# EAGLE design LASERTAG (EAGLE 6.6.0)
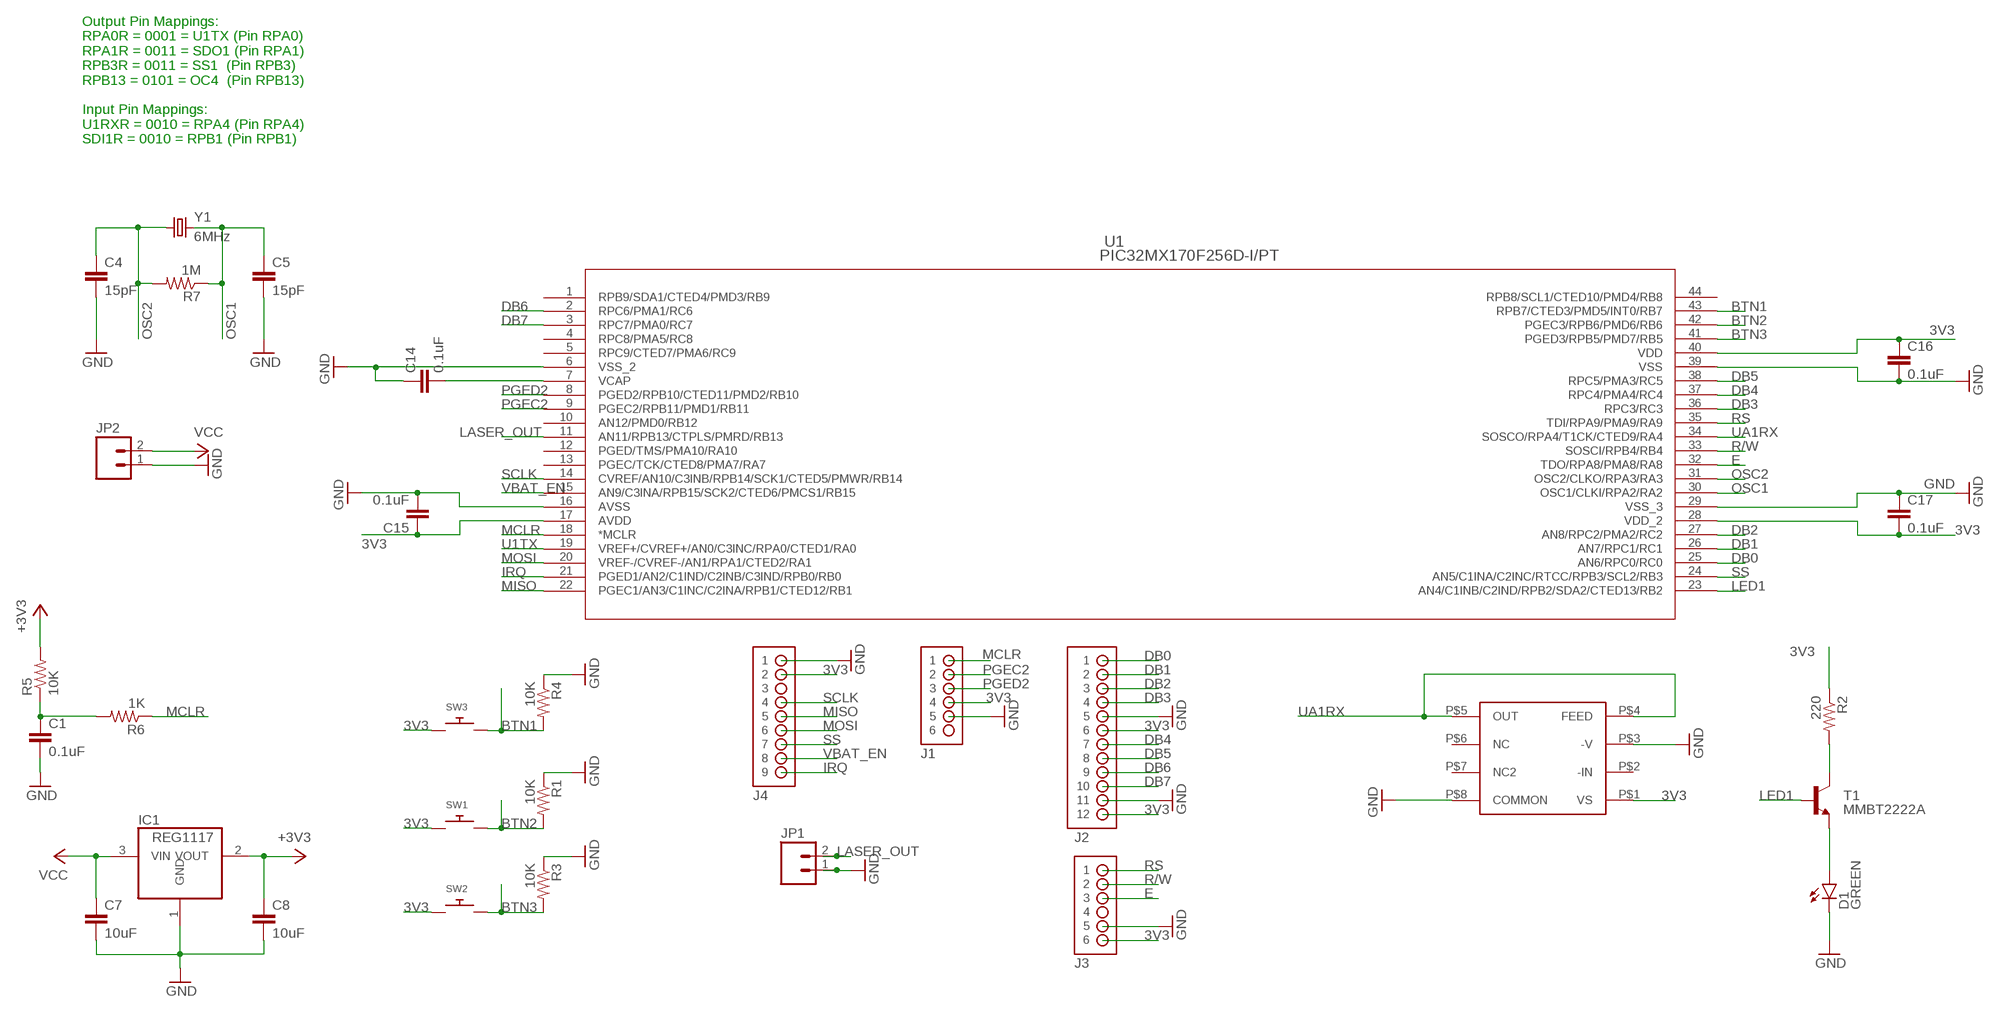
[diagram p0: schematic, sheet 1]

## Parts
C1  0.1uF  CAP0603-CAP  [0603-CAP]
C4  15pF  15PF-50V-5%(0603)  [0603-CAP]
C5  15pF  15PF-50V-5%(0603)  [0603-CAP]
C7  10uF  10UF-6.3V-20%(0603)  [0603-CAP]
C8  10uF  10UF-6.3V-20%(0603)  [0603-CAP]
C14  0.1uF  CAP0603-CAP  [0603-CAP]
C15  0.1uF  CAP0603-CAP  [0603-CAP]
C16  0.1uF  CAP0603-CAP  [0603-CAP]
C17  0.1uF  CAP0603-CAP  [0603-CAP]
D1  GREEN  LED-GREEN0603  [LED-0603]
IC1  REG1117  [SOT223]
IC3  OPT101P  [OPT101P]
J1  HDR-1X6  [HDR-1X6]
J2  PMOD-2X6-P  [PMOD-2X6-P]
J3  HDR-1X6  [HDR-1X6]
J4  HDR-1X9  [HDR-1X9]
JP1  M02JST-PTH-2  [JST-2-PTH]
JP2  M02JST-PTH-2  [JST-2-PTH]
R1  10K  RESISTOR0603-RES  [0603-RES]
R2  220  RESISTOR0603-RES  [0603-RES]
R3  10K  RESISTOR0603-RES  [0603-RES]
R4  10K  RESISTOR0603-RES  [0603-RES]
R5  10K  RESISTOR0603-RES  [0603-RES]
R6  1K  RESISTOR0603-RES  [0603-RES]
R7  1M  1MOHM-1/10W-1%(0603)  [0603-RES]
SW1  SWITCH_PUSHBUTTONC&K_KSS  [BTN_CK_KSS]
SW2  SWITCH_PUSHBUTTONC&K_KSS  [BTN_CK_KSS]
SW3  SWITCH_PUSHBUTTONC&K_KSS  [BTN_CK_KSS]
T1  MMBT2222A  TRANSISTOR_NPNSOT23  [SOT23]
U1  PIC32MX170F256D-I/PT  PIC32MX150F128D-I_PT  [TQFP44_10X10MC]
Y1  6MHz  CRYSTALHC49US  [HC49US]

## Nets
3V3 [vcc]: C8.1 C15.1 C16.1 C17.2 IC1.2(VOUT) IC3.P$1(VS) J1.4 J2.6 J2.12 J3.6 J4.2 R2.1 R5.2 SW1.P$1 SW2.P$1 SW3.P$1 U1.17(AVDD) U1.28(VDD_2) U1.40(VDD) ; supply symbol labelled +3V3
BTN1: R4.2 SW3.P$2 U1.43(RPB7/CTED3/PMD5/INT0/RB7)
BTN2: R1.2 SW1.P$2 U1.42(PGEC3/RPB6/PMD6/RB6)
BTN3: R3.2 SW2.P$2 U1.41(PGED3/RPB5/PMD7/RB5)
DB0: J2.1 U1.25(AN6/RPC0/RC0)
DB1: J2.2 U1.26(AN7/RPC1/RC1)
DB2: J2.3 U1.27(AN8/RPC2/PMA2/RC2)
DB3: J2.4 U1.36(RPC3/RC3)
DB4: J2.7 U1.37(RPC4/PMA4/RC4)
DB5: J2.8 U1.38(RPC5/PMA3/RC5)
DB6: J2.9 U1.2(RPC6/PMA1/RC6)
DB7: J2.10 U1.3(RPC7/PMA0/RC7)
E: J3.3 U1.32(TDO/RPA8/PMA8/RA8)
GND: C1.2 C4.2 C5.2 C7.2 C8.2 C14.1 C15.2 C16.2 C17.1 D1.C IC1.1(GND) IC3.P$3(-V) IC3.P$8(COMMON) J1.5 J2.5 J2.11 J3.5 J4.1 JP1.1 JP2.1 R1.1 R3.1 R4.1 U1.6(VSS_2) U1.16(AVSS) U1.29(VSS_3) U1.39(VSS)
IRQ: J4.9 U1.21(PGED1/AN2/C1IND/C2INB/C3IND/RPB0/RB0)
LASER_OUT: JP1.2 U1.11(AN11/RPB13/CTPLS/PMRD/RB13)
LED1: T1.1(B) U1.23(AN4/C1INB/C2IND/RPB2/SDA2/CTED13/RB2)
MCLR: J1.1 R6.1 U1.18(*MCLR)
MISO: J4.5 U1.22(PGEC1/AN3/C1INC/C2INA/RPB1/CTED12/RB1)
MOSI: J4.6 U1.20(VREF-/CVREF-/AN1/RPA1/CTED2/RA1)
N$5: C1.1 R5.1 R6.2
N$10: C14.2 U1.7(VCAP)
N$11: R2.2 T1.3(C)
N$12: D1.A T1.2(E)
OSC1: C5.1 R7.1 U1.30(OSC1/CLKI/RPA2/RA2) Y1.2
OSC2: C4.1 R7.2 U1.31(OSC2/CLKO/RPA3/RA3) Y1.1
PGEC2: J1.2 U1.9(PGEC2/RPB11/PMD1/RB11)
PGED2: J1.3 U1.8(PGED2/RPB10/CTED11/PMD2/RB10)
R/W: J3.2 U1.33(SOSCI/RPB4/RB4)
RS: J3.1 U1.35(TDI/RPA9/PMA9/RA9)
SCLK: J4.4 U1.14(CVREF/AN10/C3INB/RPB14/SCK1/CTED5/PMWR/RB14)
SS: J4.7 U1.24(AN5/C1INA/C2INC/RTCC/RPB3/SCL2/RB3)
U1TX: U1.19(VREF+/CVREF+/AN0/C3INC/RPA0/CTED1/RA0)
UA1RX: IC3.P$4(FEED) IC3.P$5(OUT) U1.34(SOSCO/RPA4/T1CK/CTED9/RA4)
VBAT_EN: J4.8 U1.15(AN9/C3INA/RPB15/SCK2/CTED6/PMCS1/RB15)
VCC [vcc]: C7.1 IC1.3(VIN) JP2.2
Unconnected: IC3.P$2(-IN) IC3.P$6(NC) IC3.P$7(NC2) J1.6 J3.4 J4.3 U1.1(RPB9/SDA1/CTED4/PMD3/RB9) U1.4(RPC8/PMA5/RC8) U1.5(RPC9/CTED7/PMA6/RC9) U1.10(AN12/PMD0/RB12) U1.12(PGED/TMS/PMA10/RA10) U1.13(PGEC/TCK/CTED8/PMA7/RA7) U1.44(RPB8/SCL1/CTED10/PMD4/RB8)

## Notes on the sheet
- Output Pin Mappings:
  RPA0R = 0001 = U1TX (Pin RPA0)
  RPA1R = 0011 = SDO1 (Pin RPA1)
  RPB3R = 0011 = SS1  (Pin RPB3)
  RPB13 = 0101 = OC4  (Pin RPB13)
  
  Input Pin Mappings:
  U1RXR = 0010 = RPA4 (Pin RPA4)
  SDI1R = 0010 = RPB1 (Pin RPB1)

## Library data of the parts
C1 C14-C17 = SparkFun-Passives:CAP: Capacitor Standard 0603 ceramic capacitor, and 0.1" leaded capacitor.; EAGLEUP: C0603
C4 C5 = SparkFun-Capacitors:15PF-50V-5%(0603): CAP-07881; EAGLEUP: C0603; PROD_ID: CAP-07881
C7 C8 = SparkFun-Capacitors:10UF-6.3V-20%(0603): CAP-11015; EAGLEUP: C0603; PROD_ID: CAP-11015
D1 = SparkFun-LED:LED-GREEN: Various green LEDs Green LEDs used in SFE Production 0603- DIO-00821 LARGE- DIO-00862 LILYPAD- DIO-09910; PROD_ID: DIO-00821
IC1 = burr-brown_2:REG1117: 800mA and 1A Low Dropout (LDO) Positive Regulator 1.8V, 2.5V, 2.85V, 3.3V, 5V, and Adj; MPN: REG1117; OC_FARNELL: 1097566; OC_NEWARK: 14P6981
IC3 = opt101p:OPT101P
J1 J3 = Digilent:HDR-1X6
J2 = Mechanical:PMOD-2X6-P: PMOD 2x6 Peripheral board (male) connector
J4 = Digilent:HDR-1X9
JP1 JP2 = SparkFun-Connectors:M02: Standard 2-pin 0.1" header. Use with - straight break away headers ( PRT-00116) - right angle break away headers (PRT-00553) - swiss pins (PRT-00743) - machine pins (PRT-00117) - female headers (PRT-00115) Molex polarized connector foot print use with: PRT-08233 with associated crimp pins and housings. 2.54_SCREWTERM for use with PRT-10571. 3.5mm Screw Terminal footprints for PRT-08084 5mm Screw Terminal footprints for use with PRT-08432; PROD_ID: CONN-09863; SKU: PRT-09914
R1-R4 = SparkFun-Passives:RESISTOR: Resistor Basic schematic elements and footprints for 0603, 1206, and PTH resistors.
R5 R6 = SparkFun-Passives:RESISTOR: Resistor Basic schematic elements and footprints for 0603, 1206, and PTH resistors.; EAGLEUP: R0603
R7 = SparkFun-Resistors:1MOHM-1/10W-1%(0603): RES-07868; EAGLEUP: R0603; PROD_ID: RES-07868
SW1-SW3 = adafruit:SWITCH_PUSHBUTTON: Buttons SOFTTOUCHSMD_SJ - Soft touch temporary push button (Super Junk Akihabara) Compatible with SKPMANE010 [Mouser: 688-SKPMAN] C&K_KSS = Digikey: KSS221GLFS
T1 = SparkFun:TRANSISTOR_NPN: Transistor NPN BJT configuration in SOT23 package. MMBT2222 is the common NPN we use. Double check BCE configuration again layout.
U1 = PIC32MX170F256D:PIC32MX150F128D-I_PT
Y1 = SparkFun-FreqCtrl:CRYSTAL: Various standard crystals. Proven footprints.

## Net classes
1 vcc: width 0.406 mm

## Board
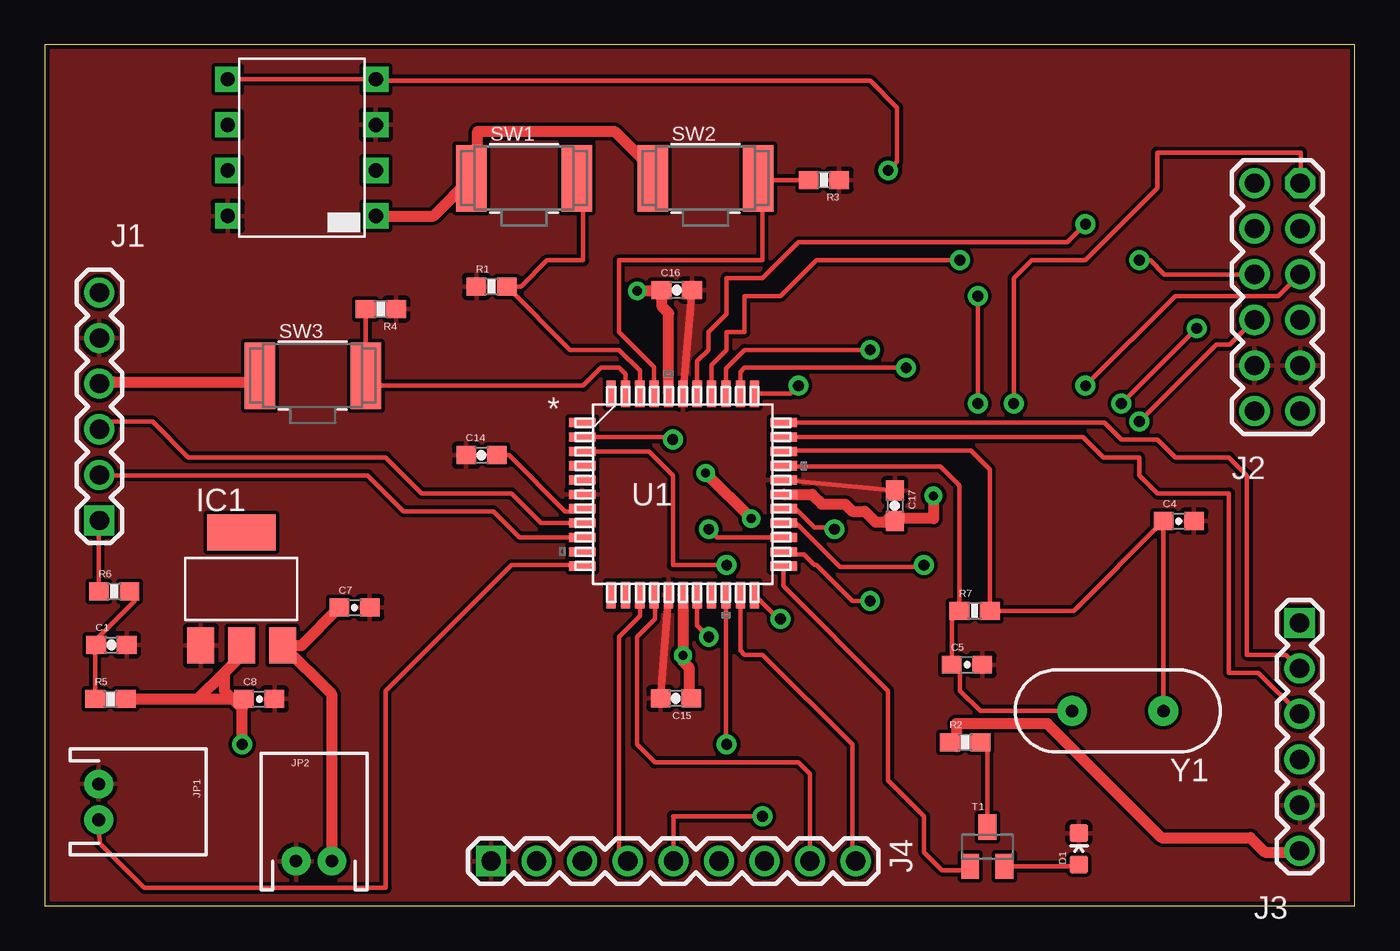
[diagram p1: board, top side]
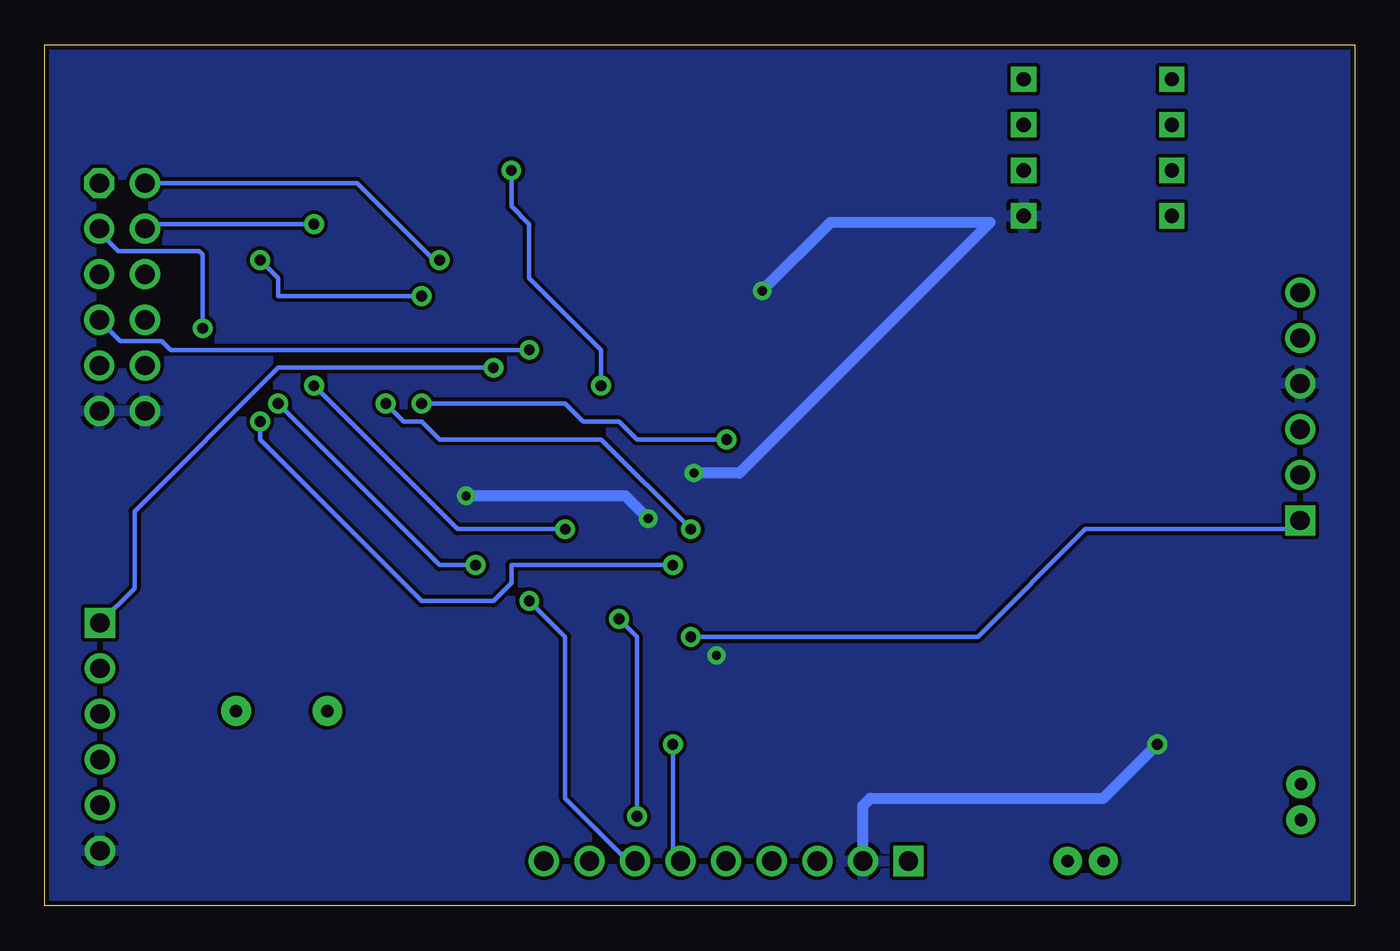
[diagram p2: board, bottom side, seen from below]

Size 73 x 48 mm. Coordinates in mm from the lower left corner, seen from the top.
Outline: 0,0 73,0 73,48 0,48 0,0
Copper layers (1*16): Top 0.035mm / dielectric 1.5mm / Bottom 0.035mm
Design rules "SparkFun": minimum track width 8mil, minimum drill 20mil, track to track 8mil, track to pad 8mil, pad to pad 8mil, via to via 8mil, smd to smd 8mil, copper to edge 10mil, drill to drill 8mil, minimum pad ring 12mil, minimum via ring 10mil, stop-mask expansion 4mil, vias tented up to drill 25mil, thermal gap 10mil

### Footprints (pad centres in the part's own frame; a part is rotated, then mirrored left to right if it is on the bottom)
0603-CAP = smd 1.1 x 1: 1 -0.85,0; 2 0.85,0
LED-0603 = smd 1 x 1: A 0,-0.877; C 0,0.877
SOT223 = smd 1.499 x 2.007: 1 -2.261,-3.15; 2 0.025,-3.15; 3 2.311,-3.15 | smd 3.81 x 2.007: 4 0,3.15
OPT101P = drill 0.8 square: P$1 7.625,1.14; P$2 7.625,3.685; P$3 7.625,6.225; P$4 7.625,8.765; P$5 -0.635,8.765; P$6 -0.635,6.225; P$7 -0.635,3.685; P$8 -0.635,1.14
HDR-1X6 = drill 1.067 square: 1 0,6.35 | drill 1.067: 2 0,3.81; 3 0,1.27; 4 0,-1.27; 5 0,-3.81; 6 0,-6.35
PMOD-2X6-P = drill 1.067 octagon: 1 1.27,6.35 | drill 1.067: 2 1.27,3.81; 3 1.27,1.27; 4 1.27,-1.27; 5 1.27,-3.81; 6 1.27,-6.35; 7 -1.27,6.35; 8 -1.27,3.81; 9 -1.27,1.27; 10 -1.27,-1.27; 11 -1.27,-3.81; 12 -1.27,-6.35
HDR-1X9 = drill 1.067 square: 1 0,10.16 | drill 1.067: 2 0,7.62; 3 0,5.08; 4 0,2.54; 5 0,0; 6 0,-2.54; 7 0,-5.08; 8 0,-7.62; 9 0,-10.16
JST-2-PTH = drill 0.7 pad 1.6: 1 -1,0; 2 1,0
0603-RES = smd 1.1 x 1: 1 -0.85,0; 2 0.85,0
BTN_CK_KSS = smd 1.7 x 3.7: P$1 -2.95,0; P$2 2.95,0
SOT23 = smd 1 x 1.4: 1 -0.95,-1.1; 2 0.95,-1.1; 3 0,1.1
TQFP44_10X10MC = smd 1.473 x 0.508: 1 -5.613,4; 2 -5.613,3.2; 3 -5.613,2.4; 4 -5.613,1.6; 5 -5.613,0.8; 6 -5.613,0; 7 -5.613,-0.8; 8 -5.613,-1.6; 9 -5.613,-2.4; 10 -5.613,-3.2; 11 -5.613,-4; 23 5.613,-4; 24 5.613,-3.2; 25 5.613,-2.4; 26 5.613,-1.6; 27 5.613,-0.8; 28 5.613,0; 29 5.613,0.8; 30 5.613,1.6; 31 5.613,2.4; 32 5.613,3.2; 33 5.613,4 | smd 0.508 x 1.473: 12 -4,-5.613; 13 -3.2,-5.613; 14 -2.4,-5.613; 15 -1.6,-5.613; 16 -0.8,-5.613; 17 0,-5.613; 18 0.8,-5.613; 19 1.6,-5.613; 20 2.4,-5.613; 21 3.2,-5.613; 22 4,-5.613; 34 4,5.613; 35 3.2,5.613; 36 2.4,5.613; 37 1.6,5.613; 38 0.8,5.613; 39 0,5.613; 40 -0.8,5.613; 41 -1.6,5.613; 42 -2.4,5.613; 43 -3.2,5.613; 44 -4,5.613
HC49US = drill 0.7 pad 1.651: 1 -2.54,0; 2 2.54,0

### Placement (x,y rotation side)
C1  3.71,14.55 0 top
C4  63.2,21.45 0 top
C5  51.39,13.45 0 top
C7  17.26,16.63 0 top
C8  11.95,11.53 0 top
C14  24.34,25.13 0 top
C15  35.17,11.57 180 top
C16  35.22,34.33 0 top
C17  47.37,22.31 270 top
D1  57.63,3.18 0 top
IC1  10.95,17.67 0 top
IC3  10.82,37.32 0 top
J1  3.04,27.84 180 top
J2  68.69,33.94 0 top
J3  69.93,9.43 0 top
J4  35.03,2.5 90 top
JP1  3,5.8 270 top
JP2  15,2.5 0 top
R1  24.9,34.53 0 top
R2  51.29,9.13 0 top
R3  43.42,40.47 180 top
R4  18.73,33.27 180 top
R5  3.66,11.53 0 top
R6  3.86,17.54 0 top
R7  51.82,16.45 0 top
SW1  26.71,40.56 0 top
SW2  36.82,40.56 0 top
SW3  14.93,29.56 0 top
T1  52.52,3.3 0 top
U1  35.56,22.94 0 top
Y1  59.8,10.87 180 top

### Tracks (layer width: path | path; a pad name or v marks a point on that pad's centre or on a via)
3V3  (via drill 0.51, 0.6)
  Top 0.61: U1.28 42.76,22.94 43.3,22.4 44.6,22.4 45,22 45.7,22 46.3,21.4 47.31,21.4 C17.2 46.99,21.59 49.53,21.59 v49.53,22.86 | U1.40 34.76,33.04 34.4,33.4 34.4,34.3 C16.1 34.29,34.29 v33.02,34.29 | U1.17 v35.56,13.97 35.56,13.64 35.9,13.3 35.9,11.69 C15.1 | R2.1 50.8,8.89 50.8,10.16 55.88,10.16 62.23,3.81 67.19,3.81 68,3 69.85,3 J3.6 | SW3.P$1 11.43,29.21 3.81,29.21 J1.4 | SW2.P$1 34.29,40.64 31.75,43.18 24.13,43.18 24.13,40.64 SW1.P$1 21.66,38.46 IC3.P$1 | v36.83,24.13 v39.37,21.59 | R5.2 8.53,11.53 | 8.53,11.53 10,13 | 10,13 11,14 11,14.5 IC1.2 | 8.53,11.53 C8.1 | 10,13 10,12 11,11 v11,9
  Bottom 0.61: v33.02,34.29 29.21,38.1 20.32,38.1 34.29,24.13 v36.83,24.13 | v49.53,22.86 40.64,22.86 v39.37,21.59 | J4.2 27.41,5.59 27,6 14,6 v11,9
  pour Bottom: 0,0 73,0 73,48 0,48
BTN1
  Top 0.254: R4.2 SW3.P$2 18.44,29 30,29 31,30 32,30 32.36,29.64 U1.43
BTN2
  Top 0.254: U1.42 33.16,29.84 32,31 29.28,31 R1.2 26.53,34.53 28,36 30,36 30,40.22 SW1.P$2
BTN3
  Top 0.254: U1.41 33.96,30.04 32,32 32,36 40,36 40,40.33 SW2.P$2 39.86,40.47 R3.2
DB0  (via drill 0.6)
  Top 0.254: U1.25 37.46,20.54 v37,21 | v54,28 54,35 55,36 58,36 62,40 62,42 70,42 70,40.33 J2.1
  Bottom 0.254: v37,21 42,26 51,26 52,27 53,27 v54,28
DB1  (via drill 0.6)
  Top 0.254: U1.26 41.86,21.34 44.3,18.9 48.9,18.9 v49,19 | v60,28 v64.2,32.2
  Bottom 0.254: v49,19 51,19 v60,28 | J2.2 69.96,37.56 68.9,36.5 64.4,36.5 64.2,36.3 v64.2,32.2
DB2  (via drill 0.6)
  Top 0.254: U1.27 41.86,22.14 42.9,21.1 43.9,21.1 v44,21 | v58,29 63,34 68.75,34 J2.3
  Bottom 0.254: v44,21 50,21 v58,29
DB3  (via drill 0.6)
  Top 0.254: U1.36 37.96,29.96 39,31 v46,31
  Bottom 0.254: v46,31 66,31 66.5,31.5 68.79,31.5 J2.4
DB4  (via drill 0.6)
  Top 0.254: U1.37 37.16,30.16 38,31 38,32 39,32 39,34 41,34 43,36 v51,36
  Bottom 0.254: v51,36 51.3,36 55.6,40.3 J2.7
DB5  (via drill 0.6)
  Top 0.254: U1.38 36.36,30.36 37,31 37,32 38,33 38,35 40,35 42,37 57,37 v58,38
  Bottom 0.254: v58,38 67.17,38 J2.8
DB6  (via drill 0.6)
  Top 0.254: U1.2 34.86,26.14 v35,26 | v52,28 v52,34 | v61,36 61.6,36 62.4,35.2 J2.9
  Bottom 0.254: v35,26 40,26 41,27 43,27 44,28 v52,28 | v52,34 60,34 60,35 v61,36
DB7  (via drill 0.6)
  Top 0.254: U1.3 33.66,25.34 35,24 35,19 v38,19 | v61,27 65.3,31.3 66.05,31.3 J2.10
  Bottom 0.254: v38,19 47,19 47,18 48,17 52,17 61,26 v61,27
E
  Top 0.254: U1.32 57.86,26.14 59,25 61,25 61,24 62,23 66,23 66,13 67.63,13 J3.3
GND
  Top 0.254: U1.29 C17.1
  Top 0.406: U1.39 C16.2 | U1.16 C15.2
  pour Top: 0,0 73,0 73,48 0,48
IRQ
  Top 0.254: U1.21 38.76,14.24 39,14 40,14 45,9 45,2.69 J4.9
LASER_OUT
  Top 0.254: U1.11 29.89,19 26,19 19,12 19,1 5.55,1 3.05,3.5 JP1.2
LED1
  Top 0.254: U1.23 41.17,17.83 47,12 47,7 49,5 49,3 50,2 51.37,2 T1.1
MCLR  (via drill 0.6)
  Top 0.254: R6.1 3.01,21.46 J1.1 | U1.18 36.36,15.64 v37,15
  Bottom 0.254: v37,15 21,15 15,21 3.53,21 J1.1
MISO  (via drill 0.6)
  Top 0.254: J4.5 35.03,4.97 35,5 v40,5 | v41,16 40.89,16 U1.22
  Bottom 0.254: v40,5 40,15 v41,16
MOSI  (via drill 0.6)
  Top 0.254: U1.20 37.96,9.04 v38,9
  Bottom 0.254: v38,9 38,2.93 J4.6
N$5
  Top 0.254: R6.2 5,17.25 5,17 2.86,14.86 C1.1 2.81,14.5 R5.1
N$10
  Top 0.254: C14.2 25.87,25.13 29,22 29.81,22 U1.7
N$11
  Top 0.254: T1.3 52.52,8.75 R2.2
N$12
  Top 0.254: T1.2 57.53,2.2 D1.A
OSC1
  Top 0.254: U1.30 41.21,24.5 49.9,24.5 50.97,23.43 R7.1 50.54,16.02 C5.1 51,12.99 51,12 52.13,10.87 Y1.2
OSC2
  Top 0.254: Y1.1 C4.1 57.35,16.45 R7.2 52.67,24.33 51.6,25.4 41.23,25.4 U1.31
PGEC2
  Top 0.254: U1.9 26.46,20.54 25,22 20,22 18,24 3.07,24 J1.2
PGED2
  Top 0.254: U1.8 27.66,21.34 26,23 21,23 19,25 8,25 6,27 3.47,27 J1.3
R/W
  Top 0.254: U1.33 59.06,26.94 60,26 62,26 63,25 66,25 67,24 67,14 69.17,14 J3.2
RS  (via drill 0.6)
  Top 0.254: U1.35 38.76,29.76 39,30 v48,30
  Bottom 0.254: v48,30 60,30 68,22 68,17.71 J3.1
SCLK
  Top 0.254: U1.14 33.16,16.16 32,15 32,2.99 J4.4
SS  (via drill 0.6)
  Top 0.254: v46,17 45,17 43,19 42.9,19 42.3,19.6 41.31,19.6 U1.24
  Bottom 0.254: J4.7 40.5,2.5 44,6 44,15 v46,17
UA1RX  (via drill 0.6)
  Top 0.254: U1.34 41.55,28.55 v42,29 | IC3.P$5 IC3.P$4 18.53,46 46,46 47.49,44.51 47.49,41.49 v47,41
  Bottom 0.254: v42,29 42,31 46,35 46,38 47,39 v47,41
VBAT_EN
  Top 0.254: J4.8 42.65,7.35 42,8 34,8 33,9 33,15 34,16 34,17.29 U1.15
VCC
  Top 0.61: C7.1 14.3,14.52 IC1.3 16,11.78 JP2.2